# EAGLE design nrf52_watch_rev_0_9 (EAGLE 9.2.1)
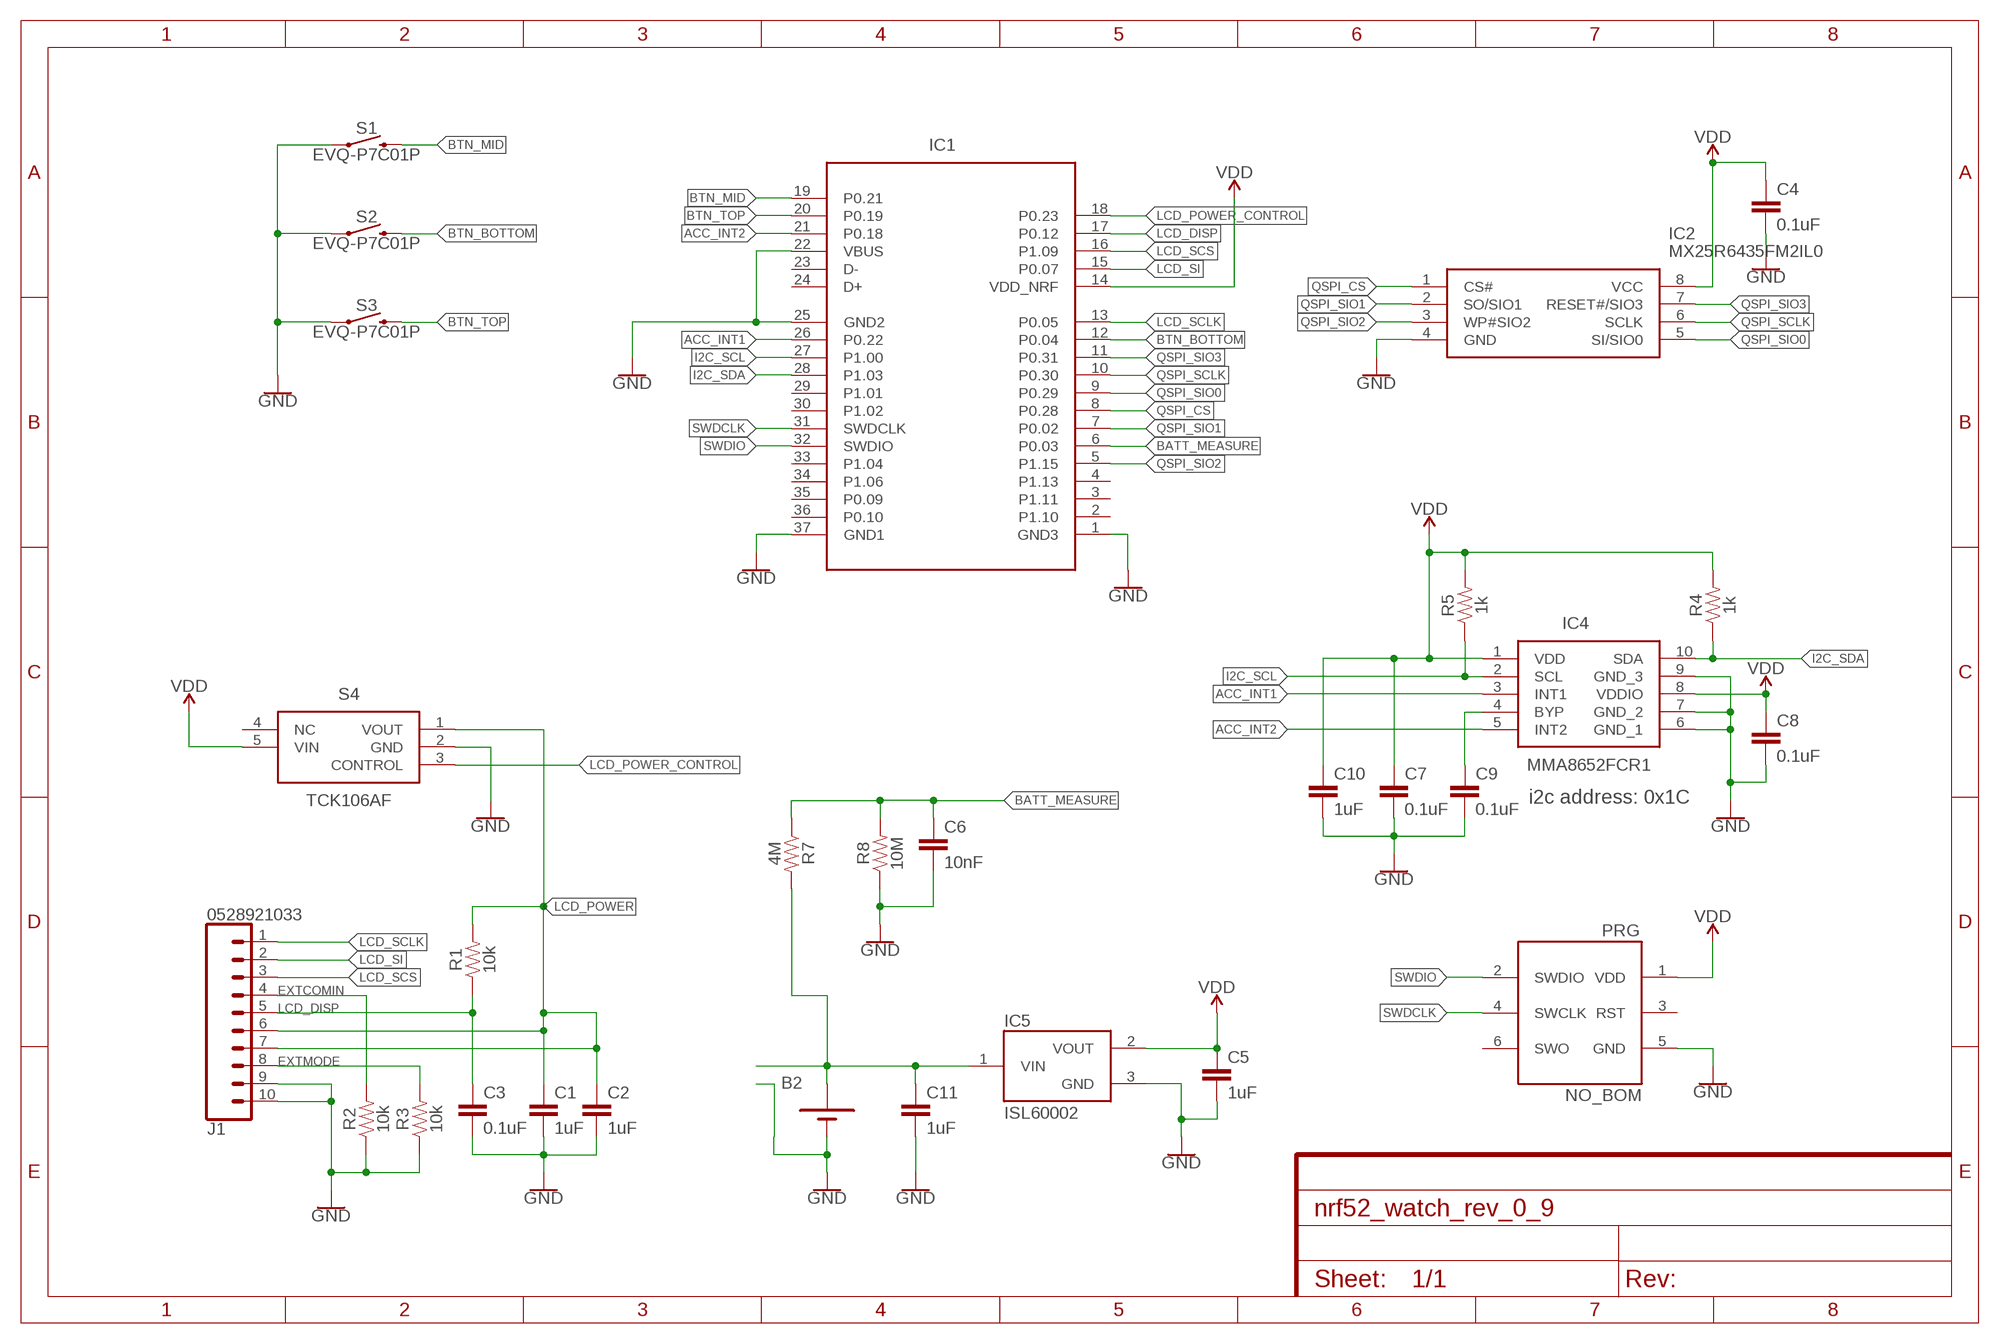
[diagram p0: schematic, sheet 1]

## Parts
B2  BATTERY-BK-916  [BK-916-TR]
C1  1uF  CAP-6.3V-20%-0402  [C0402]
C2  1uF  CAP-6.3V-20%-0402  [C0402]
C3  0.1uF  CAP-6.3V-20%-0402  [C0402]
C4  0.1uF  CAP-6.3V-20%-0402  [C0402]
C5  1uF  CAP-6.3V-20%-0402  [C0402]
C6  10nF  CAP-6.3V-20%-0402  [C0402]
C7  0.1uF  CAP-6.3V-20%-0402  [C0402]
C8  0.1uF  CAP-6.3V-20%-0402  [C0402]
C9  0.1uF  CAP-6.3V-20%-0402  [C0402]
C10  1uF  CAP-6.3V-20%-0402  [C0402]
C11  1uF  CAP-6.3V-20%-0402  [C0402]
IC1  HOLYIOT_18010  [HOLYIOT_18010_REDUCED]
IC2  MX25R6435FM2IL0  [SOIC127P790X216-8N]
IC4  MMA8652FCR1  [SON40P200X200X100-10N]
IC5  ISL60002  [SOT23-3]
J1  0528921033  [0528921033]
PRG  NO_BOM  SWD_PROG_POGO  [1X06_1.27MM]
R1  10k  RES-0.063W-5%-0402  [R0402]
R2  10k  RES-0.063W-5%-0402  [R0402]
R3  10k  RES-0.063W-5%-0402  [R0402]
R4  1k  RES-0.063W-5%-0402  [R0402]
R5  1k  RES-0.063W-5%-0402  [R0402]
R7  4M  RES-0.063W-1%-0402  [R0402]
R8  10M  RES-0.063W-1%-0402  [R0402]
S1  EVQ-P7C01P  [EVQP7C01P]
S2  EVQ-P7C01P  [EVQP7C01P]
S3  EVQ-P7C01P  [EVQP7C01P]
S4  TCK106AF  [SOT-25]

## Nets
ACC_INT1: IC1.26(P0.22) IC4.3(INT1)
ACC_INT2: IC1.21(P0.18) IC4.5(INT2)
BATT_MEASURE: C6.1 IC1.6(P0.03) R7.1 R8.2
BTN_BOTTOM: IC1.12(P0.04) S2.1 S2.4
BTN_MID: IC1.19(P0.21) S1.1 S1.4
BTN_TOP: IC1.20(P0.19) S3.1 S3.4
EXTCOMIN: J1.4 R2.2
EXTMODE: J1.8 R3.2
GND: B2.N(-) C1.2 C2.2 C3.2 C4.2 C5.2 C6.2 C7.2 C8.2 C9.2 C10.2 C11.2 IC1.1(GND3) IC1.22(VBUS) IC1.25(GND2) IC1.37(GND1) IC2.4(GND) IC4.6(GND_1) IC4.7(GND_2) IC4.9(GND_3) IC5.3(GND) J1.9 J1.10 PRG.5(GND) R2.1 R3.1 R8.1 S1.2 S1.3 S2.2 S2.3 S3.2 S3.3 S4.2(GND)
I2C_SCL: IC1.27(P1.00) IC4.2(SCL) R5.1
I2C_SDA: IC1.28(P1.03) IC4.10(SDA) R4.1
LCD_DISP: C3.1 IC1.17(P0.12) J1.5 R1.1
LCD_POWER: C1.1 C2.1 J1.6 J1.7 R1.2 S4.1(VOUT)
LCD_POWER_CONTROL: IC1.18(P0.23) S4.3(CONTROL)
LCD_SCLK: IC1.13(P0.05) J1.1
LCD_SCS: IC1.16(P1.09) J1.3
LCD_SI: IC1.15(P0.07) J1.2
N$1: B2.P1(+) B2.P2(+) C11.1 IC5.1(VIN) R7.2
N$3: C9.1 IC4.4(BYP)
QSPI_CS: IC1.8(P0.28) IC2.1(CS#)
QSPI_SCLK: IC1.10(P0.30) IC2.6(SCLK)
QSPI_SIO0: IC1.9(P0.29) IC2.5(SI/SIO0)
QSPI_SIO1: IC1.7(P0.02) IC2.2(SO/SIO1)
QSPI_SIO2: IC1.5(P1.15) IC2.3(WP#SIO2)
QSPI_SIO3: IC1.11(P0.31) IC2.7(RESET#/SIO3)
SWDCLK: IC1.31(SWDCLK) PRG.4(SWCLK)
SWDIO: IC1.32(SWDIO) PRG.2(SWDIO)
VDD: C4.1 C5.1 C7.1 C8.1 C10.1 IC1.14(VDD_NRF) IC2.8(VCC) IC4.1(VDD) IC4.8(VDDIO) IC5.2(VOUT) PRG.1(VDD) R4.2 R5.2 S4.5(VIN)
Unconnected: IC1.2(P1.10) IC1.3(P1.11) IC1.4(P1.13) IC1.23(D-) IC1.24(D+) IC1.29(P1.01) IC1.30(P1.02) IC1.33(P1.04) IC1.34(P1.06) IC1.35(P0.09) IC1.36(P0.10) PRG.3(RST) PRG.6(SWO) S4.4(NC)

## Notes on the sheet
- i2c address: 0x1C

## Library data of the parts
B2 = Inventas-Misc:BATTERY: 596: https://www.digikey.com/product-detail/en/keystone-electronics/596/36-596-ND/2137852 590: https://www.digikey.com/product-detail/en/keystone-electronics/590/36-590-ND/2137886 5230: https://www.digikey.com/product-detail/en/keystone-electronics/5230/36-5230-ND/643095; MANUFACTURER_NAME: MPD; MANUFACTURER_PART_NUMBER: BK-916-TR
C1-C11 = Inventas-Passives:CAP-6.3V-20%: Ceramic capacitors
IC1 = Inventas-IC:HOLYIOT_18010; MANUFACTURER_NAME: Holyiot; MANUFACTURER_PART_NUMBER: 18010
IC2 = Inventas-IC:MX25R6435FM2IL0: MX25R6435FM2IL0, Serial NOR Flash Memory, 16 x 4 bit, 32M x 2 bit, 64M x 1 bit 64Mbit, 1.7 3.6 V, 16, 8-Pin Source: Datasheet <http://www.macronix.com/Lists/Datasheet/Attachments/6746/MX25R6435F, Wide Range, 64Mb, v1.4.pdf>; ARROW_PART_NUMBER: MX25R6435FM2IL0; ARROW_PRICE-STOCK: https://www.arrow.com/en/products/mx25r6435fm2il0/macronix-international; DESCRIPTION: MX25R6435FM2IL0, Serial NOR Flash Memory, 16 x 4 bit, 32M x 2 bit, 64M x 1 bit 64Mbit, 1.7 3.6 V, 16, 8-Pin; HEIGHT: 2.16mm; MANUFACTURER_NAME: Macronix; MANUFACTURER_PART_NUMBER: MX25R6435FM2IL0; RS_PART_NUMBER: 1703108; RS_PRICE-STOCK: http://uk.rs-online.com/web/p/products/1703108
IC4 = Inventas-IC:MMA8652FCR1: NXP MMA8652FCR1, 3-Axis Accelerometer, 2 g, 4 g, 8 g, 1.95 3.6 V, Serial-I2C, DFN 10-Pin Source: Datasheet <https://cache.freescale.com/files/sensors/doc/data_sheet/MMA8652FC.pdf>; ARROW_PART_NUMBER: MMA8652FCR1; ARROW_PRICE-STOCK: http://uk.rs-online.com/web/p/products/8016889P; DESCRIPTION: NXP MMA8652FCR1, 3-Axis Accelerometer, 2 g, 4 g, 8 g, 1.95 3.6 V, Serial-I2C, DFN 10-Pin; HEIGHT: 1mm; MANUFACTURER_NAME: NXP; MANUFACTURER_PART_NUMBER: MMA8652FCR1; RS_PART_NUMBER: 8016889P; RS_PRICE-STOCK: http://uk.rs-online.com/web/p/products/8016889P
IC5 = Inventas-Power:ISL60002
J1 = Inventas-Connectors:0528921033: FFC & FPC Connectors 0.5 FFC/FPC ZIF Hsg Assy 10Ckt EmbsTpPkg Source: Datasheet <https://www.molex.com/webdocs/datasheets/pdf/en-us/0528921033_FFC_FPC_CONNECTORS.pdf>; ARROW_PART_NUMBER: 0528921033; ARROW_PRICE-STOCK: https://www.arrow.com/en/products/0528921033/molex; DESCRIPTION: FFC & FPC Connectors 0.5 FFC/FPC ZIF Hsg Assy 10Ckt EmbsTpPkg; HEIGHT: 2mm; MANUFACTURER_NAME: Molex; MANUFACTURER_PART_NUMBER: 0528921033
PRG = Inventas-Connectors:SWD_PROG_POGO
R1-R5 = Inventas-Passives:RES-0.063W-5%-: Generic Resistor Package
R7 R8 = Inventas-Passives:RES-0.063W-1%-: Generic Resistor Package
S1-S3 = Inventas-Buttons:EVQ-P7C01P: Black Side Tactile Switch, SPST 50 mA@ 12 V dc 1.7mm Source: Datasheet <https://www.arrow.com/en/products/evqp7c01p/panasonic>; ARROW_PART_NUMBER: EVQ-P7C01P; ARROW_PRICE-STOCK: https://www.arrow.com/en/products/evqp7c01p/panasonic; DESCRIPTION: Black Side Tactile Switch, SPST 50 mA@ 12 V dc 1.7mm; HEIGHT: 1mm; MANUFACTURER_NAME: Panasonic; MANUFACTURER_PART_NUMBER: EVQ-P7C01P; RS_PART_NUMBER: 8113353; RS_PRICE-STOCK: http://uk.rs-online.com/web/p/products/8113353
S4 = Inventas-Power:TCK106AF: iC POWER DIST LOAD SWITCH SMV Source: Datasheet <https://toshiba.semicon-storage.com/info/docget.jsp?did=53240&prodName=TCK108AF>; DESCRIPTION: iC POWER DIST LOAD SWITCH SMV; HEIGHT: mm; MANUFACTURER_NAME: Toshiba; MANUFACTURER_PART_NUMBER: TCK106AF; SUPPLIER_NAME: RS

## Board
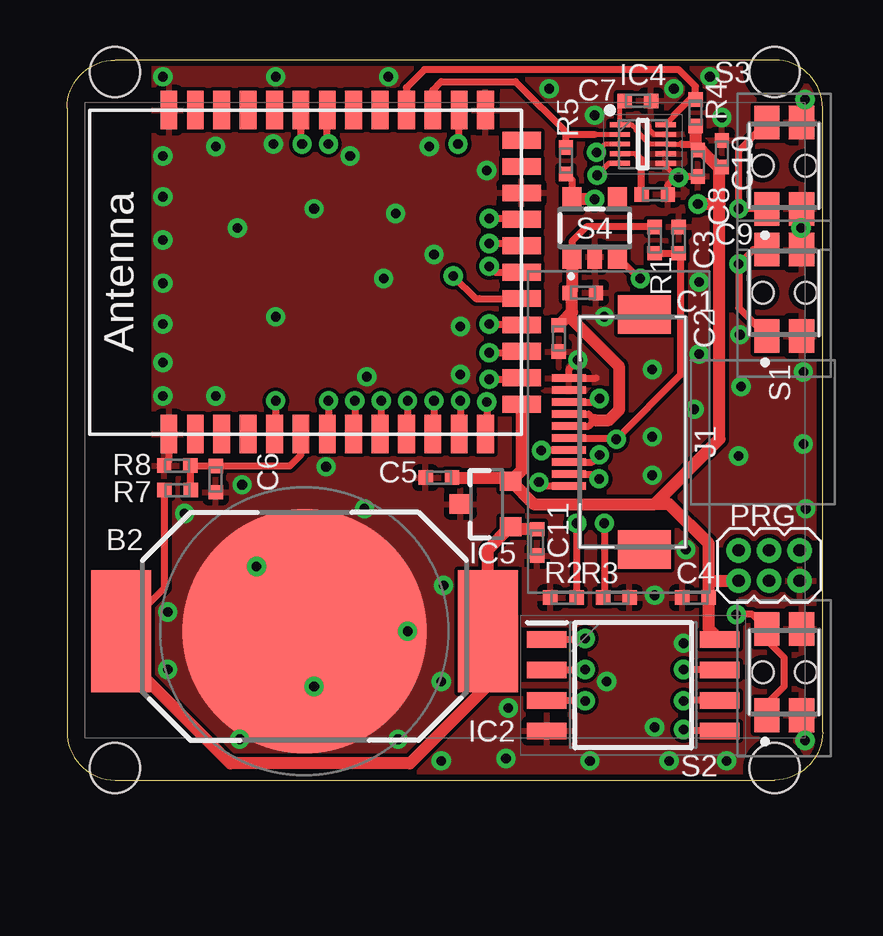
[diagram p1: board, top side]
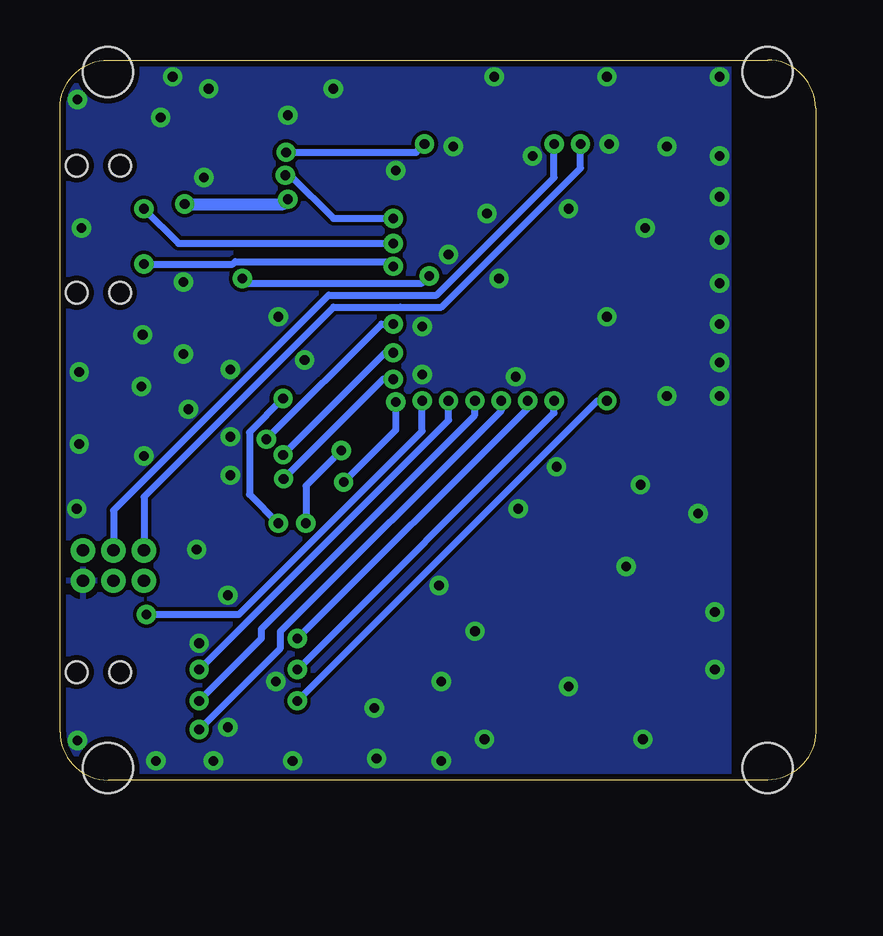
[diagram p2: board, bottom side, seen from below]

Size 31.5 x 30 mm. Coordinates in mm from the lower left corner, seen from the top.
Outline: 31.5,2 31.5,28 arc90 29.5,30 2,30 arc90 0,28 0,2 arc90 2,0 29.5,0 arc90 31.5,2
Copper layers (1*16): Top 0.035mm / dielectric 1.5mm / Bottom 0.035mm
Design rules "Elecrow_2-layer_eagle_rule": minimum track width 6mil, minimum drill 12mil, track to track 6mil, track to pad 6mil, pad to pad 6mil, via to via 6mil, smd to smd 0mil, copper to edge 10mil, drill to drill 10mil, minimum pad ring 10mil, minimum via ring 6mil, stop-mask expansion 2mil, vias tented up to drill 100mil, thermal gap 10mil
Holes 2.1 mm at 2,0.5 29.5,0.5 29.5,29.5 2,29.5
tKeepout: area 0,9 to 3.5,30
bKeepout: area 0,9 to 3.5,30
tRestrict: area 0,0 to 3.5,30
bRestrict: area 0,0 to 3.5,30

### Footprints (pad centres in the part's own frame; a part is rotated, then mirrored left to right if it is on the bottom)
BK-916-TR = smd 10.2 x 10.2: N 0,0 | smd 2.5 x 5.1: P1 7.65,0; P2 -7.65,0
C0402 = smd 0.6 x 0.6: 1 -0.55,0; 2 0.55,0
HOLYIOT_18010_REDUCED = smd 1.6 x 0.7: 1 -6.75,5.7; 2 -6.75,4.6; 3 -6.75,3.5; 4 -6.75,2.4; 5 -6.75,1.3; 6 -6.75,0.2; 7 -6.75,-0.9; 8 -6.75,-2; 9 -6.75,-3.1; 10 -6.75,-4.2; 11 -6.75,-5.3; 12 -6.75,-6.4; 13 -6.75,-7.5; 25 6.75,-7.5; 26 6.75,-6.4; 27 6.75,-5.3; 28 6.75,-4.2; 29 6.75,-3.1; 30 6.75,-2; 31 6.75,-0.9; 32 6.75,0.2; 33 6.75,1.3; 34 6.75,2.4; 35 6.75,3.5; 36 6.75,4.6; 37 6.75,5.7 | smd 0.7 x 1.6: 14 -5.5,-9; 15 -4.4,-9; 16 -3.3,-9; 17 -2.2,-9; 18 -1.1,-9; 19 0,-9; 20 1.1,-9; 21 2.2,-9; 22 3.3,-9; 23 4.4,-9; 24 5.5,-9
SOIC127P790X216-8N = smd 1.65 x 0.7: 1 -3.6,1.905; 2 -3.6,0.635; 3 -3.6,-0.635; 4 -3.6,-1.905; 5 3.6,-1.905; 6 3.6,-0.635; 7 3.6,0.635; 8 3.6,1.905
SON40P200X200X100-10N = smd 0.85 x 0.2: 1 -0.95,0.8; 2 -0.95,0.4; 3 -0.95,0; 4 -0.95,-0.4; 5 -0.95,-0.8; 6 0.95,-0.8; 7 0.95,-0.4; 8 0.95,0; 9 0.95,0.4; 10 0.95,0.8
SOT23-3 = smd 0.8 x 0.9: 1 -0.95,-1; 2 0.95,-1; 3 0,1.1
0528921033 = smd 0.3 x 1.4: 1 -2.25,2.075; 2 -1.75,2.075; 3 -1.25,2.075; 4 -0.75,2.075; 5 -0.25,2.075; 6 0.25,2.075; 7 0.75,2.075; 8 1.25,2.075; 9 1.75,2.075; 10 2.25,2.075 | smd 1.6 x 2.2: 11 -4.9,-1.075; 12 4.9,-1.075
1X06_1.27MM = drill 0.508 pad 1: 1 0,0; 2 0,1.27; 3 1.27,0; 4 1.27,1.27; 5 2.54,0; 6 2.54,1.27
R0402 = smd 0.6 x 0.6: 1 -0.55,0; 2 0.55,0
EVQP7C01P = smd 1.4 x 1.05: 1 -1.8,0.725; 2 -1.8,-0.725; 3 1.8,-0.725; 4 1.8,0.725 | hole 0.9: 0,0.9; 0,-0.9
SOT-25 = smd 0.8 x 1: 1 -0.95,-1.2; 3 0.95,-1.2; 4 0.95,1.2; 5 -0.95,1.2 | smd 0.6 x 1: 2 0,-1.2

### Placement (x,y rotation side)
B2  9.9,6.2 180 top
C1  21.5,20.3 0 top
C2  20.5,18.4 270 top
C3  25.5,22.5 90 top
C4  26.2,7.6 180 top
C5  15.5,12.6 180 top
C6  6.2,12.54 270 top
C7  23.8,28.3 0 top
C8  26.3,25.7 270 top
C9  24.5,24.4 0 top
C10  27.3,26.1 90 top
C11  19.6,9.9 270 top
IC1  9.95,21.16 90 top
IC2  23.6,3.95 0 top
IC4  24,26.5 0 top
IC5  17.5,11.5 90 top
J1  23,14.5 90 top
PRG  28,8.3 0 top
R1  24.5,22.5 90 top
R2  20.7,7.6 0 top
R3  22.9,7.6 180 top
R4  26.2,27.8 270 top
R5  20.8,25.8 270 top
R7  4.61,12.08 180 top
R8  4.6,13.1 0 top
S1  29.9,20.3 90 top
S2  29.9,4.5 90 top
S3  29.9,25.6 90 top
S4  22,23 0 top

### Tracks (layer width: path | path; a pad name or v marks a point on that pad's centre or on a via)
ACC_INT1  (via drill 0.4 pad 0.8)
  Top 0.2: IC4.3 22.42,26.5 v22.07,26.15
  Top 0.3: v16.3,26.5 16.35,26.55 IC1.26
  Bottom 0.3: v22.07,26.15 16.65,26.15 v16.3,26.5
ACC_INT2  (via drill 0.4 pad 0.8)
  Top 0.2: IC4.5 22.6,25.7 v22.1,25.2
  Top 0.3: v17.6,23.4 18.91,23.4 IC1.21
  Bottom 0.3: v22.1,25.2 21.9,25.2 20.1,23.4 v17.6,23.4
BATT_MEASURE
  Top 0.3: R7.1 R8.2 C6.1 9.29,13.09 9.75,13.55 IC1.6
BTN_BOTTOM  (via drill 0.4 pad 0.8)
  Top 0.3: S2.1 29.18,3.17 29.9,3.9 29.9,5.1 29.18,5.83 S2.4 28.57,6.9 v27.9,6.9 | v16.4,15.8 16.4,14.46 IC1.12
  Bottom 0.3: v27.9,6.9 24.04,6.9 16.4,14.54 v16.4,15.8
BTN_MID  (via drill 0.4 pad 0.8)
  Top 0.3: S1.4 28.6,22.1 v28,21.5 28,19.67 S1.1 | v17.6,21.4 17.84,21.16 IC1.19
  Bottom 0.3: v28,21.5 24.29,21.5 24.19,21.6 17.8,21.6 v17.6,21.4
BTN_TOP  (via drill 0.4 pad 0.8)
  Top 0.3: S3.1 v28,23.8 28,26.23 S3.4 | v17.6,22.36 18.86,22.36 IC1.20
  Bottom 0.3: v17.6,22.36 26.56,22.36 v28,23.8
EXTCOMIN  (via drill 0.4 pad 0.8)
  Top 0.3: J1.4 19.79,13.75 v19.77,13.73 | R2.2 v21.25,10.7
  Bottom 0.3: v19.77,13.73 21.25,12.25 v21.25,10.7
EXTMODE  (via drill 0.4 pad 0.8)
  Top 0.3: J1.8 22.05,15.75 v22.2,15.9 | v22.4,10.7 22.4,7.65 R3.2
  Bottom 0.3: v22.2,15.9 22.9,15.2 22.9,15.19 23.6,14.49 23.6,11.9 v22.4,10.7
GND  (via drill 0.4 pad 0.8)
  Top 0.2: 24.2,27.3 24.27,27.23 24.27,27.09 24.47,26.9 IC4.9 | IC4.6 24.95,25.6 25.4,25.15
  Top 0.3: C8.2 25.4,25.15 25.05,24.8 C9.2 | v21.3,17.5 20.93,17.12 J1.10 22.05,16.75 | R8.1 4.25,13.3 IC1.1
  other vias: 30.6,23 28.05,18.55 26.8,29.3 25.5,25.1 25.3,28.8 20.1,28.8 26.35,20.75 26.35,17.75 26.15,15.45 17.5,25.4 15.3,21.9 11.8,26 15.1,26.4 13.7,23.6 4,26 4,24.3 4,22.5 4,20.7 4,19 4,16 4,17.4 8.6,26.5 16.4,18.9 16.4,16.9 12.5,16.8 10.3,23.8 13.2,20.9 6.2,16 8.7,19.3 7.1,23 6.2,26.4 10.8,13.05 12.4,11.3 4.2,7 14.2,6.2 13.8,1.7 15.6,4.1 18.3,0.9 18.4,3 22.5,4.1 24.5,2.2 21.8,0.8 25.1,0.8 27.5,0.8 25.8,9.6 24.5,7.7 25.7,5.7 24.4,12.7 30.8,11.3 30.7,17 30.7,14 28,13.5 28.1,16.4 22.4,19.3 24.4,17.1 24.4,14.3 13.4,29.3 4,29.3 8.7,29.3 15.7,8.1 7.3,12.3 7.9,8.9 4.9,11.1 4.2,4.6 7.2,1.7 10.3,3.9 15.6,0.8 27.3,27.6 22,27.7 30.77,28.35 30.77,1.65
  pour Bottom: -12.5,34.5 44.5,34.5 44.5,-6.5 -12.5,-6.5
  pour Top: -9,32.5 42.5,32.5 42.5,-3.5 -9,-3.5
I2C_SCL
  Top 0.2: 22,26.9 IC4.2
  Top 0.3: IC1.27 15.25,28.75 15.6,29.1 18.7,29.1 20.9,26.9 | 20.9,26.9 20.8,26.9 R5.1 | 20.9,26.9 22,26.9
I2C_SDA
  Top 0.2: IC4.10 25.3,27.65 25.3,27.7
  Top 0.3: 25.3,27.7 25.95,28.35 R4.1 26.2,28.9 25.5,29.6 14.9,29.6 14.15,28.85 IC1.28
LCD_DISP  (via drill 0.4 pad 0.8)
  Top 0.3: R1.1 C3.1 25.6,21.85 25.6,16.9 v22.9,14.2 22.84,14.25 J1.5 | v17.6,19 18.91,19 IC1.17
  Bottom 0.3: v22.9,14.2 18.09,19 v17.6,19
LCD_POWER
  Top 0.3: J1.7 21.75,15.25 22,15 21.75,14.75 J1.6 | R1.2 21.65,23.05 21.05,22.45 S4.1
  Top 0.5: S4.1 21.05,20.4 | 21.05,20.4 C1.1 | 20.9,19.35 21.05,19.5 21.05,20.4 | 20.9,19.35 23,17.25 23,15.4 22.6,15 22,15 | C2.1 20.9,19.35
LCD_POWER_CONTROL  (via drill 0.4 pad 0.8)
  Top 0.3: S4.3 23.85,20.9 v23.9,20.9 | v16.1,21 17.04,20.06 17.2,20.06 IC1.18
  Bottom 0.3: v23.9,20.9 23.7,20.7 16.4,20.7 v16.1,21
LCD_SCLK  (via drill 0.4 pad 0.8)
  Top 0.3: J1.1 19.84,12.25 v19.67,12.41 | v17.5,15.75 17.5,14.46 IC1.13
  Bottom 0.3: v19.67,12.41 17.5,14.59 v17.5,15.75
LCD_SCS  (via drill 0.4 pad 0.8)
  Top 0.3: J1.3 21.9,13.25 v22.2,13.55 | v17.6,17.8 18.89,17.8 IC1.16
  Bottom 0.3: v22.2,13.55 17.95,17.8 v17.6,17.8
LCD_SI  (via drill 0.4 pad 0.8)
  Top 0.3: J1.2 21.98,12.75 v22.18,12.55 | v17.6,16.7 18.89,16.7 IC1.15
  Bottom 0.3: v22.18,12.55 18.02,16.7 v17.6,16.7
N$1
  Top 0.3: B2.P1 4.06,8.01 R7.2
  Top 0.5: B2.P2 17.55,9.6 18.48,10.53 | 18.48,10.53 IC5.1 | C11.1 18.55,10.45 18.48,10.53 | B2.P2 17.55,7.45 | 2.25,7.25 B2.P1 2.25,5.25 6.8,0.7 14.3,0.7 17.55,3.95 B2.P2
N$3
  Top 0.2: 23.8,26 23.7,26.1 IC4.4
  Top 0.3: C9.1 23.95,25.85 23.8,26
QSPI_CS  (via drill 0.4 pad 0.8)
  Top 0.3: IC2.1 21.55,5.86 v21.6,5.9 | v12,15.8 12,14.46 IC1.8
  Bottom 0.3: v21.6,5.9 12,15.5 v12,15.8
QSPI_SCLK  (via drill 0.4 pad 0.8)
  Top 0.3: IC2.6 25.71,3.31 v25.7,3.3 | v14.2,15.8 14.2,14.46 IC1.10
  Bottom 0.3: v25.7,3.3 23.1,5.9 23.1,6.3 14.2,15.2 v14.2,15.8
QSPI_SIO0  (via drill 0.4 pad 0.8)
  Top 0.3: IC2.5 25.75,2.04 v25.7,2.1 | v13.1,15.8 13.1,14.46 IC1.9
  Bottom 0.3: v25.7,2.1 22.3,5.5 22.3,6.19 13.1,15.39 v13.1,15.8
QSPI_SIO1  (via drill 0.4 pad 0.8)
  Top 0.3: IC2.2 21.59,4.58 v21.6,4.6 | v10.9,15.8 10.9,14.46 IC1.7
  Bottom 0.3: v21.6,4.6 10.9,15.3 v10.9,15.8
QSPI_SIO2  (via drill 0.4 pad 0.8)
  Top 0.3: IC2.3 21.59,3.31 v21.6,3.3 | v8.7,15.8 8.7,14.46 IC1.5
  Bottom 0.3: v8.7,15.8 9.1,15.8 v21.6,3.3
QSPI_SIO3  (via drill 0.4 pad 0.8)
  Top 0.3: IC2.7 25.71,4.58 v25.7,4.6 | v15.3,15.8 15.3,14.46 IC1.11
  Bottom 0.3: v25.7,4.6 15.3,15 v15.3,15.8
SWDCLK  (via drill 0.4 pad 0.8)
  Top 0.3: v10.9,26.5 10.85,26.55 IC1.31
  Bottom 0.3: v10.9,26.5 10.9,25.1 15.8,20.2 20.3,20.2 29.27,11.23 PRG.4
SWDIO  (via drill 0.4 pad 0.8)
  Top 0.3: v9.8,26.5 9.75,26.55 IC1.32
  Bottom 0.3: v9.8,26.5 9.8,25.5 15.6,19.7 17.31,19.7 20.1,19.7 28,11.8 PRG.2
VDD  (via drill 0.4 pad 0.8)
  Top 0.2: 25.6,26.5 IC4.8 24.3,26.5 23.73,27.07 23.73,27.11 23.53,27.3 IC4.1 23.05,28.1 C7.1
  Top 0.3: 25.6,26.5 26.2,26.5 | R5.2 21.05,25 S4.5
  Top 0.5: C5.1 18.35,12.6 IC5.2 | IC1.14 18.95,12.9 IC5.2 | IC5.2 19.45,11.5 24.5,11.5 | 27.2,24 27.2,25.5 | 27.2,25.5 26.45,26.25 | 26.45,26.25 C8.1 | R4.2 26.2,26.5 26.45,26.25 | 27.2,24 v26.3,24 | v22,24.2 S4.5 | IC2.8 26.75,6.3 C4.1 26.75,8.3 | 24.5,11.5 27.2,14.2 27.2,24 | 24.5,11.5 25.1,11.5 26.75,9.85 26.75,8.3 | C10.1 27.25,25.5 27.2,25.5 | 26.75,8.3 PRG.1
  Bottom 0.5: v26.3,24 22.2,24 v22,24.2